# Altium schematic sheet TSAL Schematic(2024).SchDoc
size A
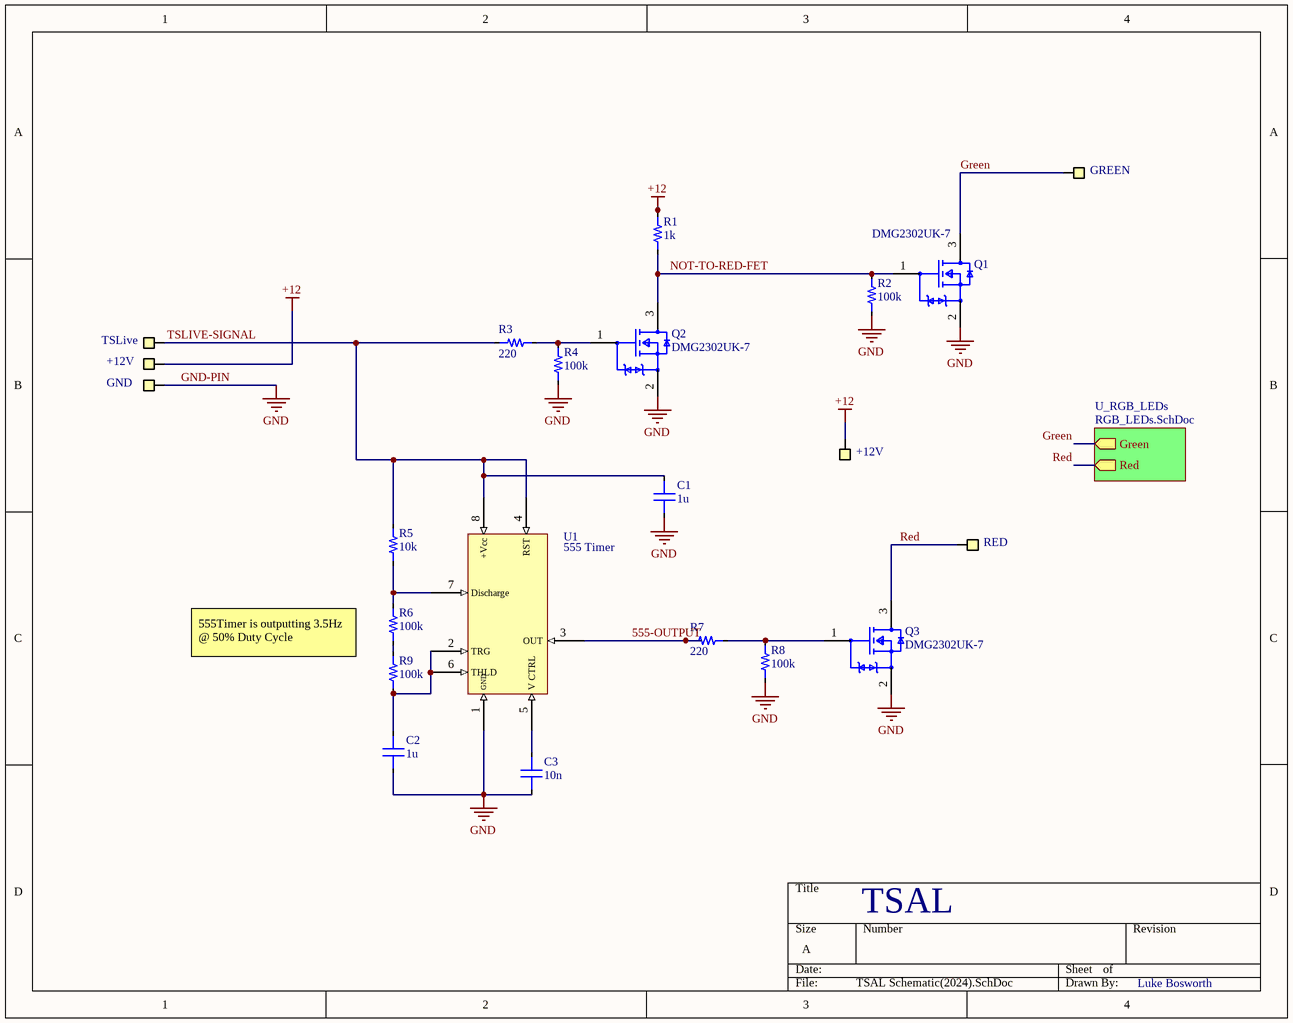
[diagram p0: TSAL Schematic(2024).SchDoc]

## Parts
C1  1u  [0603_CAP]
C2  1u  [0603_CAP]
C3  10n  [0603_CAP]
Q1  DMG2302UK-7  [SOT23-3]
Q2  DMG2302UK-7  [SOT23-3]
Q3  DMG2302UK-7  [SOT23-3]
R1  1k  [0603_RES]
R2  100k  [0603_RES]
R3  220  [0603_RES]
R4  100k  [0603_RES]
R5  10k  [0603_RES]
R6  value 100k  [0603_RES]  (hidden comment: Resistor)
R7  220  [0603_RES]
R8  100k  [0603_RES]
R9  100k  [0603_RES]
U1  555 Timer  [SOIC-8]
X1  GenericPinHeader(0.1in)  [GenericPinHeader(.1in)]  (value not drawn)
X2  GenericPinHeader(0.1in)  [GenericPinHeader(.1in)]  (value not drawn)
X3  GenericPinHeader(0.1in)  [GenericPinHeader(.1in)]  (value not drawn)
X4  GenericPinHeader(0.1in)  [GenericPinHeader(.1in)]  (value not drawn)
X5  GenericPinHeader(0.1in)  [GenericPinHeader(.1in)]  (value not drawn)
X6  GenericPinHeader(0.1in)  [GenericPinHeader(.1in)]  (value not drawn)

## Sub-sheets
U_RGB_LEDs = RGB_LEDs.SchDoc: Green (out), Red (out)

## Nets
+12: R1.1 X3.1(Pin) X5.1(Pin)
GND-PIN: C1.1 C2.1 C3.1 Q1.2(S) Q2.2(S) Q3.2(S) R2.2 R4.2 R8.2 U1.1(GND) X4.1(Pin)  [also labelled GND]
555-OUTPUT: R7.1 U1.3(OUT)
Green: Q1.3(D) X1.1(Pin) ; sheet U_RGB_LEDs/Green
NOT-TO-RED-FET: Q1.1(G) Q2.3(D) R1.2 R2.1
Red: Q3.3(D) X6.1(Pin) ; sheet U_RGB_LEDs/Red
TSLIVE-SIGNAL: C1.2 R3.1 R5.2 U1.4(RST) U1.8(+Vcc) X2.1(Pin)
NetC2_2: C2.2 R9.1 U1.2(TRG) U1.6(THLD)
NetC3_2: C3.2 U1.5(V_CTRL)
NetQ2_1: Q2.1(G) R3.2 R4.1
NetQ3_1: Q3.1(G) R7.2 R8.1
NetR5_1: R5.1 R6.2 U1.7(Discharge)
NetR6_1: R6.1 R9.2

## Notes on the sheet
- (near X1) GREEN
- TSLive
- +12V
- GND
- (near X5) +12V
- (near X6) RED
- 555Timer is outputting 3.5Hz @ 50% Duty Cycle
- TSAL
- Luke Bosworth

## Library data of the parts
C1-C3 = Capacitor: Dielectric: *; Percent Tolerance: *; ESR: *
  C1 C2: Value: 1u
  C3: Value: 10n
Q1-Q3 = CMP-12801-000001-1: MOSFET N-CH 20V 2.8A SOT23; Manufacturer: Diodes Inc.; Reverse Recovery Time: 5.3ns; Gate Charge At Vgs: 2.8nC @ 10V; Turn On Delay Time: 0.6ns; Pulse Drain Current: 12A; Max Forward Diode Voltage: 1.2V; Reverse Recovery Charge: 0.5nC; Automotive Grade: Grade 0; Threshold Vgs Min: 0.3V; Number Of N Channels: 1; Standoff Height: 0.013mm; Typ Forward Diode Voltage: 0.7V; Drain To Source Resistance: 61mΩ; Rthja Max: 192°C/W; Max Junction Temp: +150°C; Input Capacitace At Vds: 130pF @ 10V; Threshold Vgs Max: 1V; Turn Off Delay Time: 4.2ns; Depletion Mode: False; Gate To Source Voltage: 12V; Power Dissipation: 0.66W; Device Class L1: Discrete Semiconductors; Footprint Url: https://www.diodes.com/assets/Package-Files/SOT23.pdf; Lead Free: Yes; Manufacturer Part Number: DMG2302UK-7; Temperature Range High: +150°C; Drain To Source Voltage: 20V; Category: Trans; Digikey Description: MOSFET N-CH 20V 2.8A SOT23; RoHS: TRUE; Device Class L2: Transistors; Height: 1.1mm; Automotive: Yes; Package: SOT23; Drain To Source Breakdown Voltage: 20V; Continuous Drain Current: 2.8A; ComponentLink2Description: Datasheet; Device Class L3: MOSFETs; Octopart: https://octopart.com/dmg2302uk-7-diodes+inc.-73850182; Temperature Range Low: -55°C; Temperature: -55°C to +150°C; Number Of Channels: 1; ComponentLink2URL: https://www.diodes.com/assets/Datasheets/DMG2302UK.pdf
R1-R5 R7-R9 = Resistor: Tolerance: *
  R1: Value: 1k
  R2 R4 R8 R9: Value: 100k
  R3 R7: Value: 220
  R5: Value: 10k
U1 = LM555: Generic 555 timer IC; ComponentLink1Description: Digikey; ComponentLink1URL: https://www.digikey.com/en/products/detail/texas-instruments/NA555DR/1571933
X1-X6 = GenericPinHeader(0.1in): Generic .1in(2.54mm) pitch pin header
R6 = Resistor: Tolerance: *